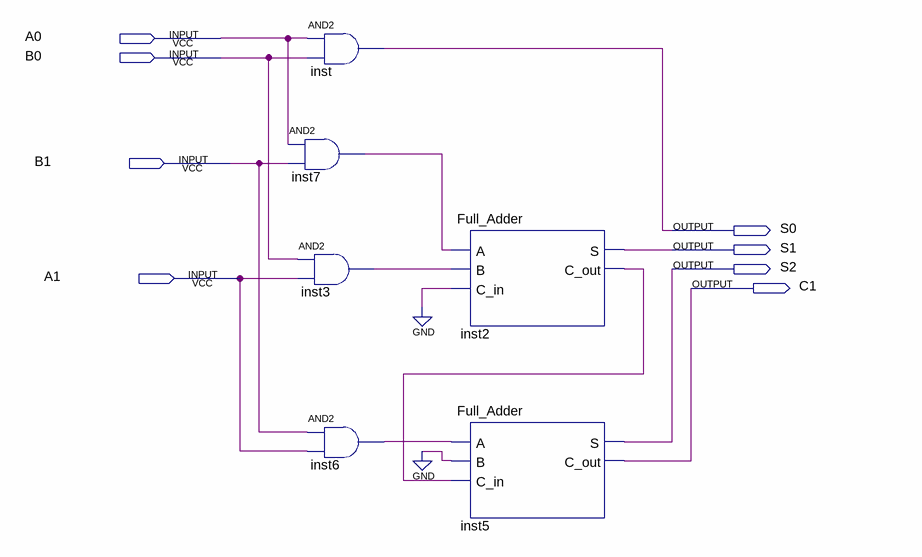
[diagram p0: schematic sheet]
// Quartus schematic Parte_B.bdf as structural Verilog: 6 symbols, 8 pins
module Parte_B (
  input  A0,
  input  B0,
  input  B1,
  input  A1,
  output S0,
  output S1,
  output S2,
  output C1
);

  wire inst2_c_out, inst3_out, inst6_out, inst7_out;

  and inst (S0, A0, B0);
  and inst7 (inst7_out, A0, B1);
  and inst3 (inst3_out, B0, A1);
  and inst6 (inst6_out, B1, A1);
  Full_Adder inst2 (.A(inst7_out), .B(inst3_out), .C_in(1'b0), .S(S1), .C_out(inst2_c_out));
  Full_Adder inst5 (.A(inst6_out), .B(1'b0), .C_in(inst2_c_out), .S(S2), .C_out(C1));
endmodule
